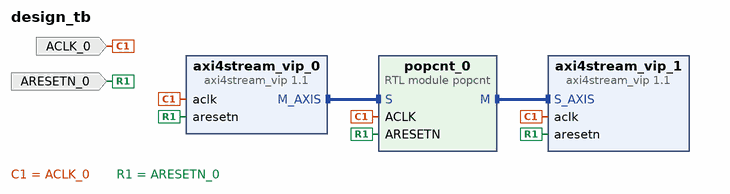
[diagram p0: block diagram of the top level]
# Vivado block design design_tb, xc7z020clg400-1, Vivado 2020.2
create_bd_design design_tb

create_bd_port -dir I -type clk ACLK_0
create_bd_port -dir I ARESETN_0

create_bd_cell -type ip -vlnv xilinx.com:ip:axi4stream_vip:1.1 axi4stream_vip_0
set_property -dict [list \
  CONFIG.HAS_TKEEP 0 \
  CONFIG.HAS_TLAST 0 \
  CONFIG.HAS_TREADY 1 \
  CONFIG.HAS_TSTRB 0 \
  CONFIG.INTERFACE_MODE MASTER \
  CONFIG.TDATA_NUM_BYTES 4 \
  CONFIG.TDEST_WIDTH 0 \
  CONFIG.TID_WIDTH 0 \
  CONFIG.TUSER_WIDTH 0 \
] [get_bd_cells axi4stream_vip_0]
create_bd_cell -type ip -vlnv xilinx.com:ip:axi4stream_vip:1.1 axi4stream_vip_1
set_property -dict {CONFIG.INTERFACE_MODE SLAVE} [get_bd_cells axi4stream_vip_1]
create_bd_cell -type module -reference popcnt popcnt_0

# ---- connections ----

connect_bd_intf_net [get_bd_intf_pins popcnt_0/M] [get_bd_intf_pins axi4stream_vip_1/S_AXIS]
connect_bd_intf_net [get_bd_intf_pins axi4stream_vip_0/M_AXIS] [get_bd_intf_pins popcnt_0/S]
connect_bd_net -net ACLK_0_1 [get_bd_ports ACLK_0] [get_bd_pins axi4stream_vip_0/aclk] [get_bd_pins axi4stream_vip_1/aclk] [get_bd_pins popcnt_0/ACLK]
connect_bd_net -net ARESET_0_1 [get_bd_ports ARESETN_0] \
  [get_bd_pins axi4stream_vip_0/aresetn] [get_bd_pins axi4stream_vip_1/aresetn] [get_bd_pins popcnt_0/ARESETN]

validate_bd_design
save_bd_design
